# Altium schematic sheet PC817C.schdoc
size 124 x 99 mm
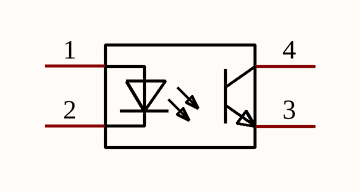
[diagram p0: PC817C.schdoc]

## Parts
U?  PC817C_C3025164  [OPTO-SMD-4_L4.6-W6.5-P2.54-LS10.3-TL]  (value not drawn)

## Nets

Not connected (* = marked no-connect by the designer): U? 1 2 3 4

## Library data of the parts
U? = PC817C_C3025164: Manufacturer: GOODWORK(固得沃克); Manufacturer Part: PC817C; Add into BOM: yes; Symbol: PC817C_C3025164; Device: PC817C_C3025164; LCSC Part Name: C档; Supplier Part: C3025164; Supplier Footprint: SMD-4P; JLCPCB Part Class: Extended Part; Datasheet: https://atta.szlcsc.com/upload/public/pdf/source/20220530/3FD5D572B823BA05C967330A07ECF74F.pdf; Supplier: LCSC; Convert to PCB: yes